# Altium project try 2.PrjPcb
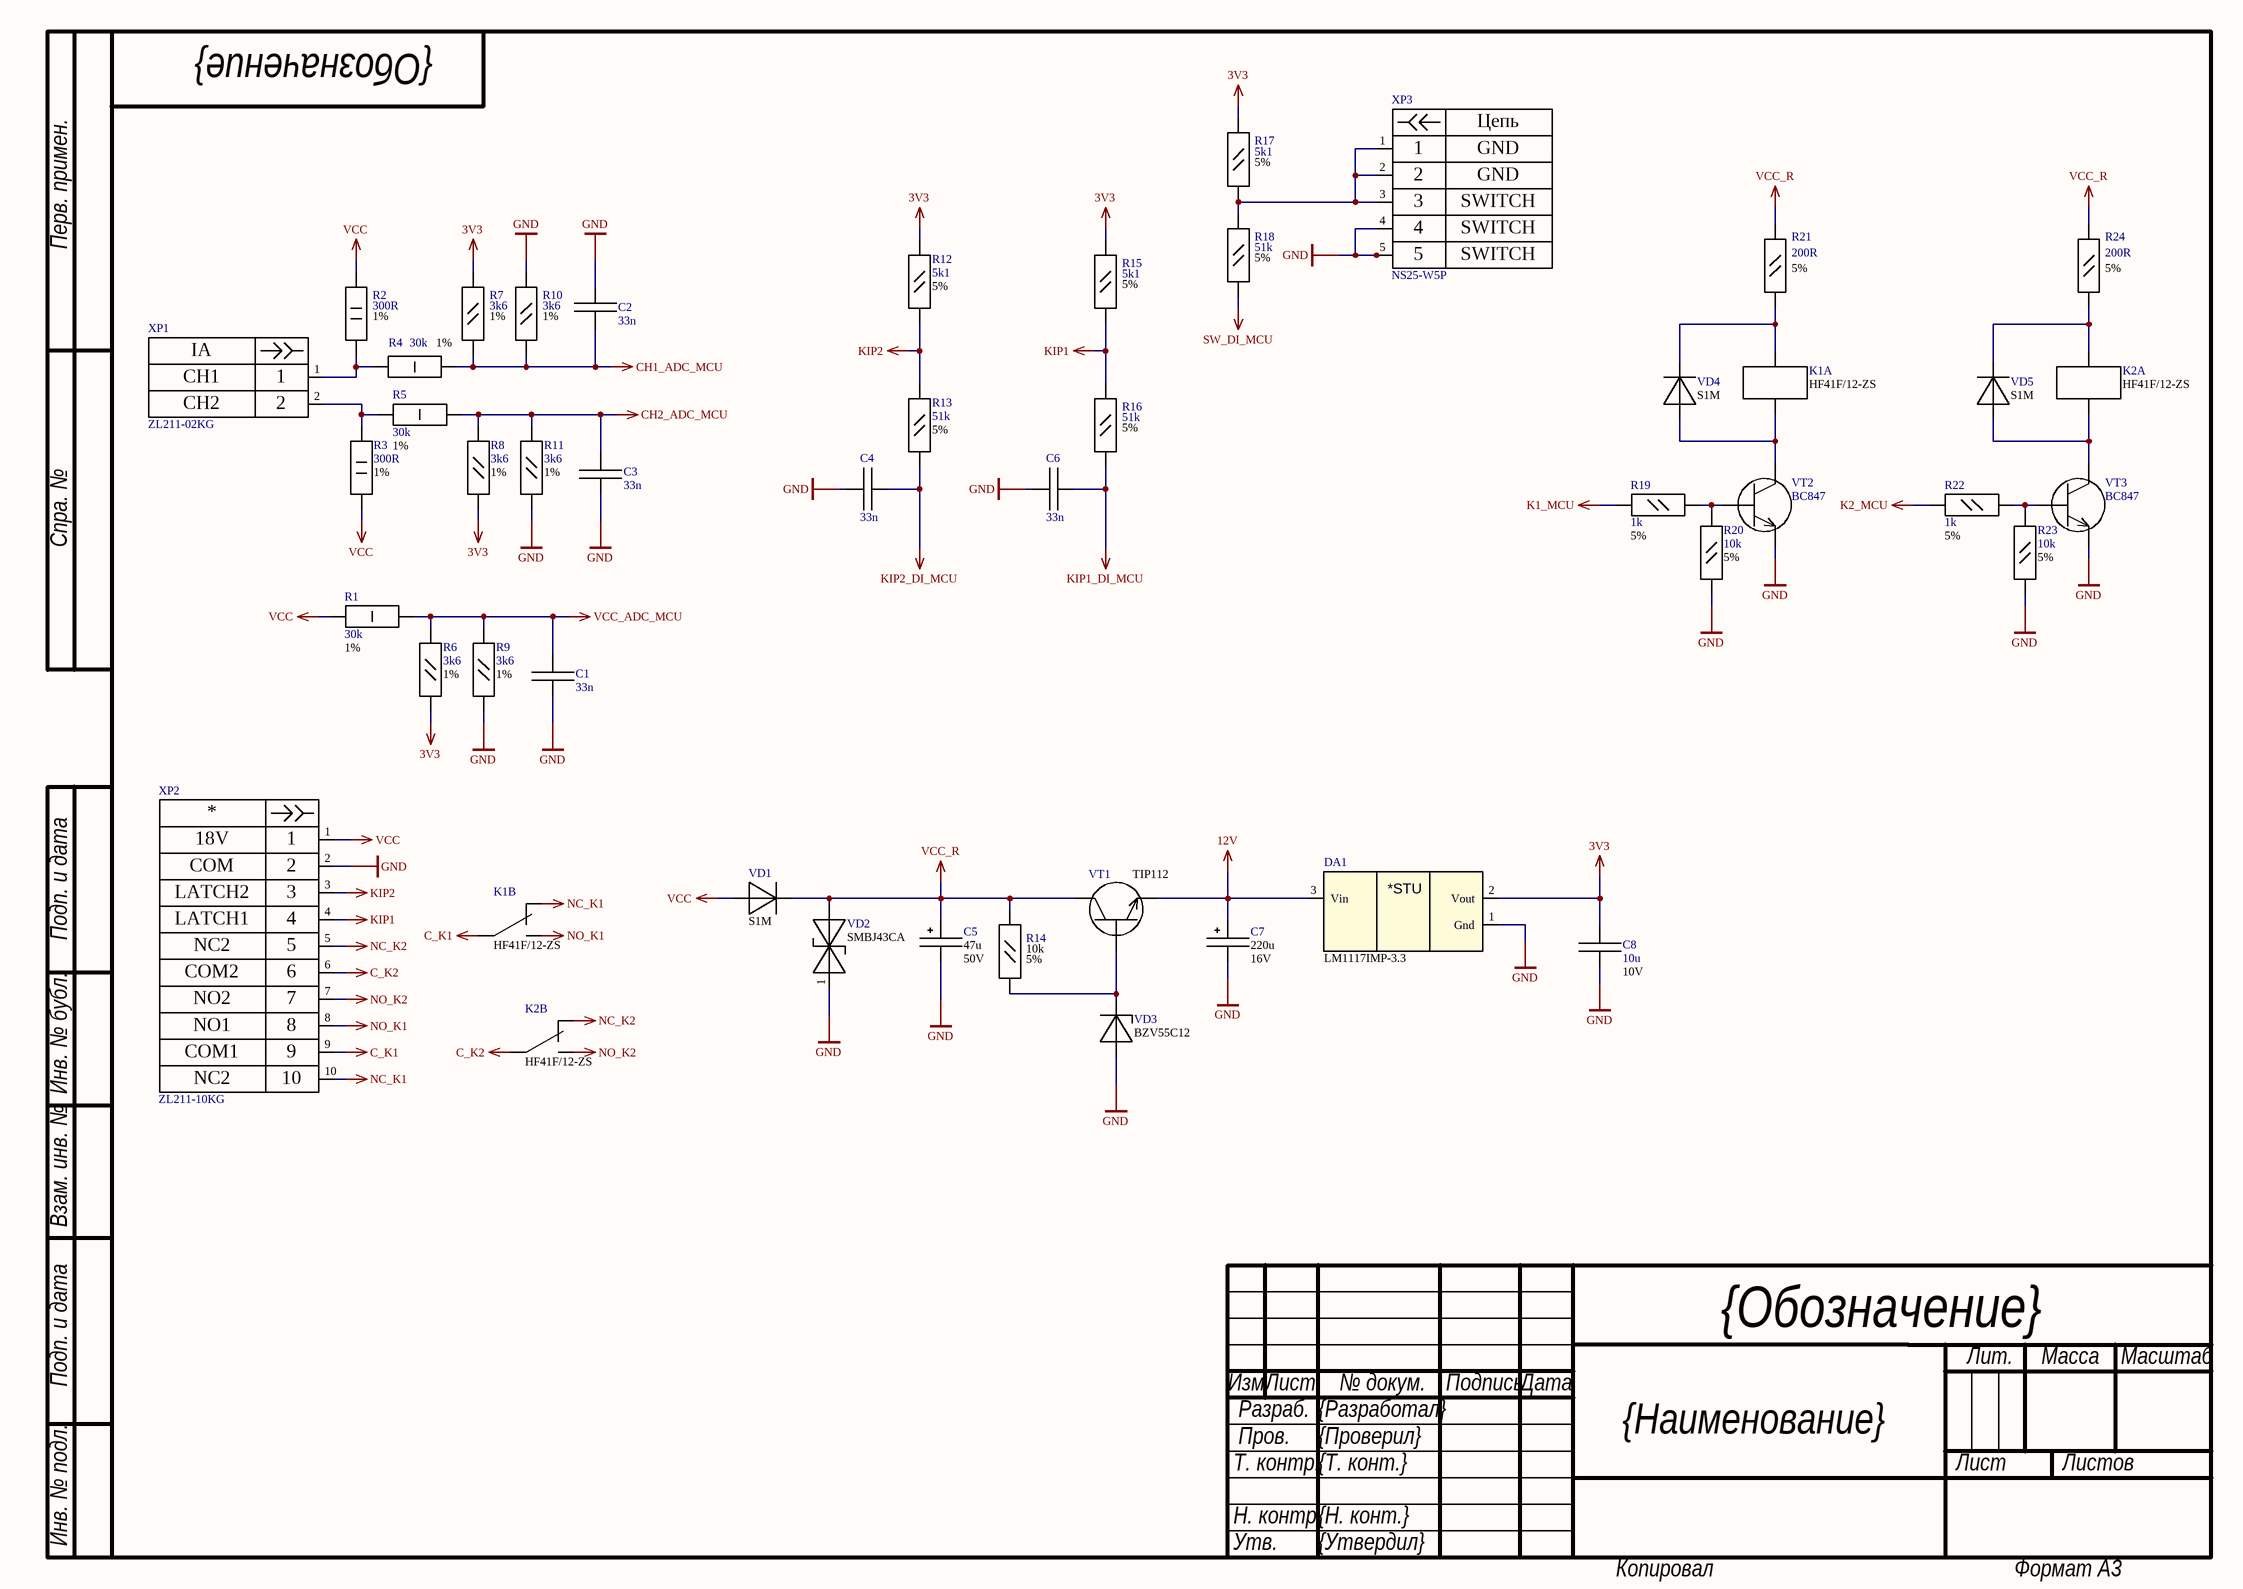
[diagram p0: Sheet2.SchDoc]
2 sheets, 64 parts. Net scope: global (net labels, ports and power ports of the same name join across sheets).
Board file: PCB1.PcbDoc
Sheets:
  Sheet2.SchDoc
  Sheet3.SchDoc

## Sheet Sheet2.SchDoc
size 420 x 297 mm; SheetNumber: 1; SheetTotal: 2; Razrabotal: {Разработал}; Prov: {Проверил}; Tkont: {Т. конт.}; Nkont: {Н. конт.}; Utv: {Утвердил}; Naimenovanie: {Наименование}; Oboznachenie: {Обозначение}; Shifr: {Шифр}

### Parts
C1  33n  [Cap Ceramic 0805]
C2  33n  [Cap Ceramic 0805]
C3  33n  [Cap Ceramic 0805]
C4  33n  [Cap Ceramic 0805]
C5  47u  Comments: 50V  [Cap electro d6.3x2.54mm]
C6  33n  [Cap Ceramic 0805]
C7  220u  Comments: 16V  [Cap electro d6.3x2.54mm]
C8  10u  Comments: 10V  [Cap Ceramic 1206]
DA1  LM1117IMP-3.3  [SOT-232]
K1  HF41F/12-ZS  [RM699V]  (parts A,B of 2)
K2  HF41F/12-ZS  [RM699V]  (parts A,B of 2)
R1  30k  Comments: 1%  [Resistor 2512]
R2  300R  Comments: 1%  [Resistor 2W d5.08x20.32 axial]
R3  300R  Comments: 1%  [Resistor 2W d5.08x20.32 axial]
R4  30k  Comments: 1%  [Resistor 2512]
R5  30k  Comments: 1%  [Resistor 2512]
R6  3k6  Comments: 1%  [Resistor 0805]
R7  3k6  Comments: 1%  [Resistor 0805]
R8  3k6  Comments: 1%  [Resistor 0805]
R9  3k6  Comments: 1%  [Resistor 0805]
R10  3k6  Comments: 1%  [Resistor 0805]
R11  3k6  Comments: 1%  [Resistor 0805]
R12  5k1  Comments: 5%  [Resistor 0805]
R13  51k  Comments: 5%  [Resistor 0805]
R14  10k  Comments: 5%  [Resistor 0805]
R15  5k1  Comments: 5%  [Resistor 0805]
R16  51k  Comments: 5%  [Resistor 0805]
R17  5k1  Comments: 5%  [Resistor 0805]
R18  51k  Comments: 5%  [Resistor 0805]
R19  1k  Comments: 5%  [Resistor 0805]
R20  10k  Comments: 5%  [Resistor 0805]
R21  200R  Comments: 5%  [Resistor 0805]
R22  1k  Comments: 5%  [Resistor 0805]
R23  10k  Comments: 5%  [Resistor 0805]
R24  200R  Comments: 5%  [Resistor 0805]
VD1  S1M  [DO-214AC SMA]
VD2  SMBJ43CA  [DO-214AA SMB]
VD3  BZV55C12  [SOD80C]
VD4  S1M  [DO-214AC SMA]
VD5  S1M  [DO-214AC SMA]
VT1  TIP112  [TO-220]
VT2  BC847  [SOT-23-3]
VT3  BC847  [SOT-23-3]
XP1  ZL211-02KG  Name1: CH1  Name: IA  Name2: CH2  [Pins 1x2]
XP2  ZL211-10KG  Name1: 18V  Name2: COM  Name3: LATCH2  Name4: LATCH1  Name5: NC2  Name6: COM2  Name7: NO2  Name8: NO1  Name9: COM1  [Pins 1x10]
XP3  NS25-W5P  Name1: GND  Name: Цепь  Name3: SWITCH  [WF-05]

### Nets
3V3: C8.2 DA1.2(Vout) R6.1 R7.1 R8.1 R12.1 R15.1 R17.1
12V: C7.2 DA1.3(Vin) VT1.3(E)
C_K1: K1.11 XP2.9
C_K2: K2.11 XP2.6
CH1_ADC_MCU: C2.2 R4.2 R7.2 R10.2
CH2_ADC_MCU: C3.2 R5.2 R8.2 R11.2
GND: C1.1 C2.1 C3.1 C4.2 C5.1 C6.2 C7.1 C8.1 DA1.1(Gnd) R9.1 R10.1 R11.1 R20.2 R23.2 VD2.1 VD3.1(A) VT2.2(E) VT3.2(E) XP2.2 XP3.4 XP3.5
K1_MCU: R19.2
K2_MCU: R22.2
KIP1: R15.2 R16.1 XP2.4
KIP1_DI_MCU: C6.1 R16.2
KIP2: R12.2 R13.1 XP2.3
KIP2_DI_MCU: C4.1 R13.2
NC_K1: K1.12 XP2.10
NC_K2: K2.12 XP2.5
NO_K1: K1.14 XP2.8
NO_K2: K2.14 XP2.7
SW_DI_MCU: R18.2
VCC: R1.1 R2.2 R3.2 VD1.1(A) XP2.1
VCC_ADC_MCU: C1.2 R1.2 R6.2 R9.2
VCC_R: C5.2 R14.1 R21.2 R24.2 VD1.2(K) VD2.2 VT1.2(K)
NetK1_1: K1.1 R21.1 VD4.2(K)
NetK1_2: K1.2 VD4.1(A) VT2.3(K)
NetK2_1: K2.1 R24.1 VD5.2(K)
NetK2_2: K2.2 VD5.1(A) VT3.3(K)
NetR2_1: R2.1 R4.1 XP1.1
NetR3_1: R3.1 R5.1 XP1.2
NetR14_2: R14.2 VD3.2(K) VT1.1(B)
NetR17_2: R17.2 R18.1 XP3.1 XP3.2 XP3.3
NetR19_1: R19.1 R20.1 VT2.1(B)
NetR22_1: R22.1 R23.1 VT3.1(B)

### Notes on the sheet
- Перв. примен.
- Спра. №
- Подп. и дата
- Инв. № бубл.
- Взам. инв. №
- Изм
- Лист
- № докум.
- Подпись
- Дата
- Лит.
- Масса
- Масштаб
- Т. контр.
- Разраб.
- Пров.
- Листов
- Инв. № подл.
- Н. контр.
- Утв.
- Копировал
- Формат А3
- (in symbol LM1117IMP-x.x) *STU

### Library data of the parts
C1-C4 C6 C8 = CerCap
  C1-C4 C6: Comments: *
C5 C7 = ECap
DA1 = LM1117IMP-x.x: Comments: *
K1 K2 = RM699V-xx11-85-xxxx: Comments: *
R1 R4 R5 = Resistor 1W
R2 R3 = Resistor 2W
R6-R24 = Resistor 0,125W
VD2 = SMBJxxCA: Comments: *
VD3 = BZV55Cxx: Comments: *
VT1 = BDW93C
XP1 = Pins 1x2: Comments: *
XP2 = Pins 1x10: Comments: *; Name: *; Name10: NC2
XP3 = Pins 1x5: Comments: *; Name2: GND; Name4: SWITCH; Name5: SWITCH
VD1 VD4 VD5 = S1M: Comments: *
VT2 VT3 = BC847: Comments: *

## Sheet Sheet3.SchDoc
size 420 x 297 mm; SheetNumber: 2; SheetTotal: 2; Razrabotal: {Разработал}; Prov: {Проверил}; Tkont: {Т. конт.}; Nkont: {Н. конт.}; Utv: {Утвердил}; Naimenovanie: {Наименование}; Oboznachenie: {Обозначение}; Shifr: {Шифр}
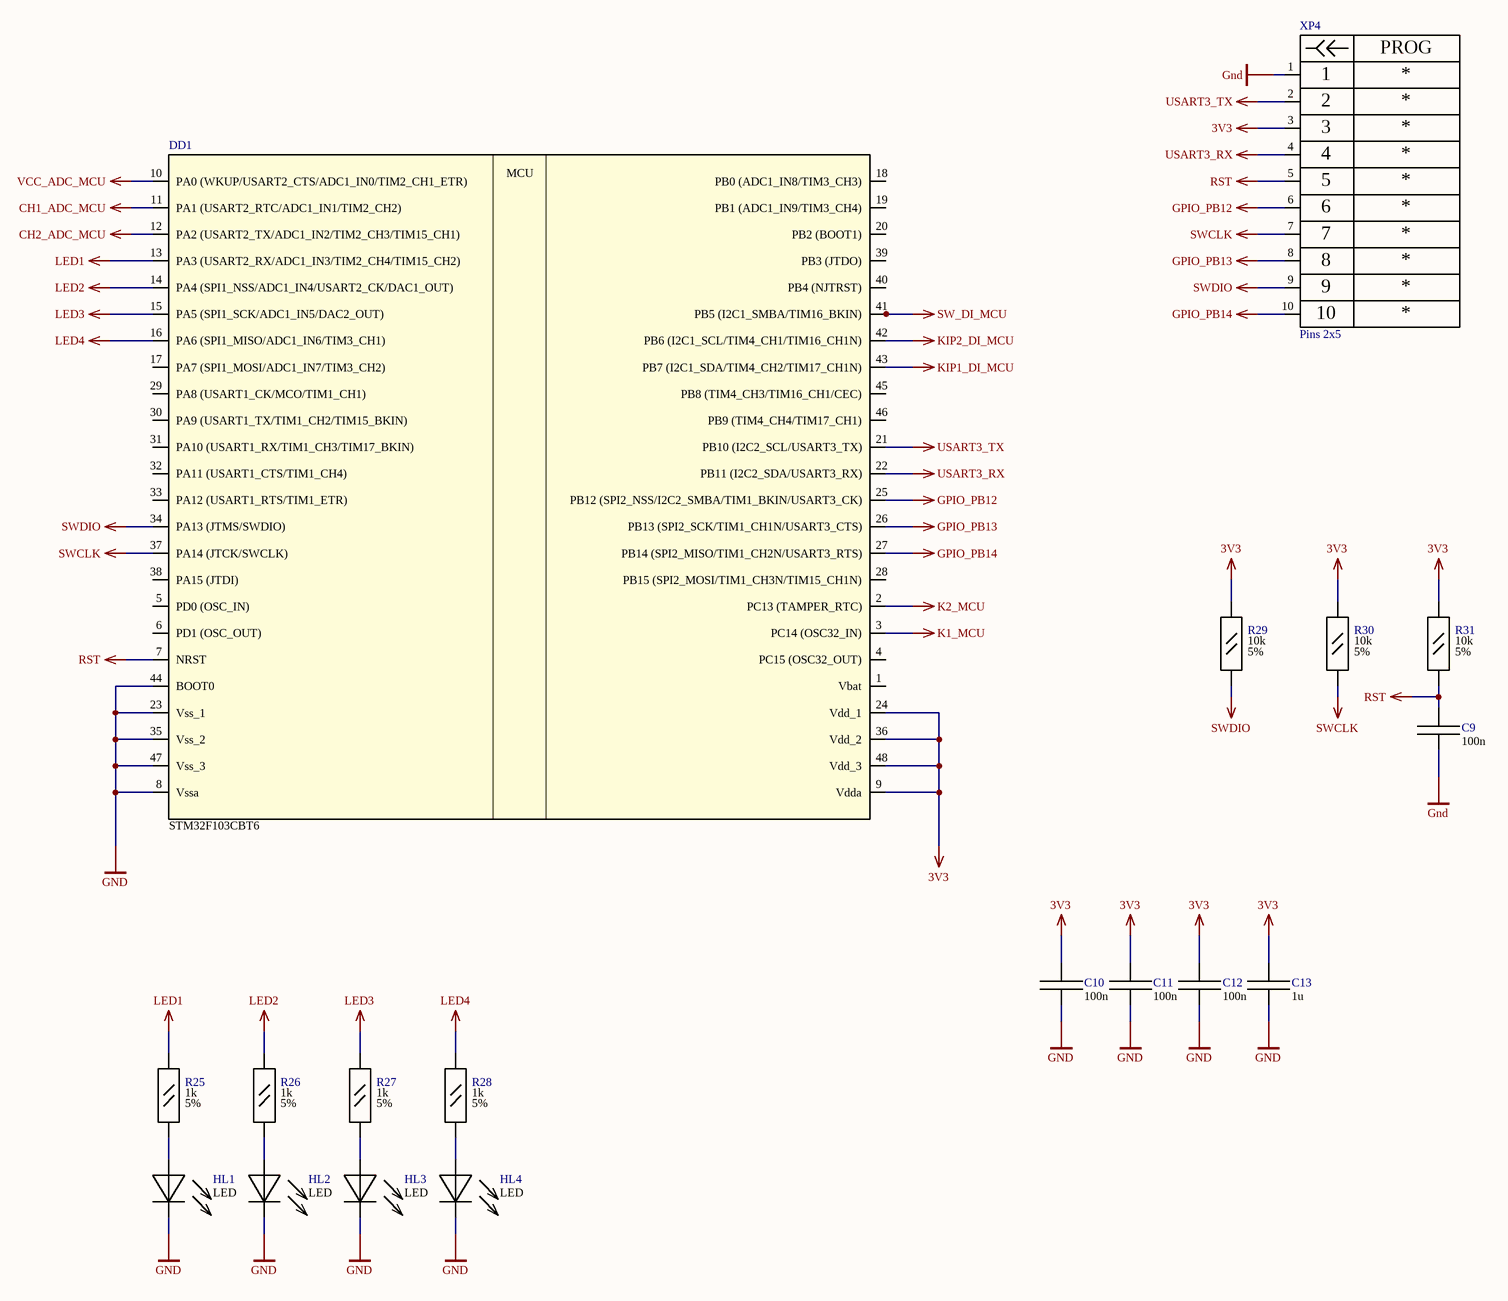
[diagram p1: Sheet3.SchDoc]

### Parts
C9  100n  [Cap Ceramic 0805]
C10  100n  [Cap Ceramic 0805]
C11  100n  [Cap Ceramic 0805]
C12  100n  [Cap Ceramic 0805]
C13  1u  [Cap Ceramic 0805]
DD1  STM32F103CBT6  [TQFP48/QFN48 S0.5]
HL1  LED  [LED S2.54d3.0]
HL2  LED  [LED S2.54d3.0]
HL3  LED  [LED S2.54d3.0]
HL4  LED  [LED S2.54d3.0]
R25  1k  Comments: 5%  [Resistor 0805]
R26  1k  Comments: 5%  [Resistor 0805]
R27  1k  Comments: 5%  [Resistor 0805]
R28  1k  Comments: 5%  [Resistor 0805]
R29  10k  Comments: 5%  [Resistor 0805]
R30  10k  Comments: 5%  [Resistor 0805]
R31  10k  Comments: 5%  [Resistor 0805]
XP4  Pins 2x5  Name: PROG  [Pins 2x5 - 1.27]

### Nets
3V3: C10.2 C11.2 C12.2 C13.2 DD1.9(Vdda) DD1.24(Vdd_1) DD1.36(Vdd_2) DD1.48(Vdd_3) R29.1 R30.1 R31.1 XP4.3
CH1_ADC_MCU: DD1.11(PA1_(USART2_RTC/ADC1_IN1/TIM2_CH2))
CH2_ADC_MCU: DD1.12(PA2_(USART2_TX/ADC1_IN2/TIM2_CH3/TIM15_CH1))
GND: C9.1 C10.1 C11.1 C12.1 C13.1 DD1.8(Vssa) DD1.23(Vss_1) DD1.35(Vss_2) DD1.44(BOOT0) DD1.47(Vss_3) HL1.2(K) HL2.2(K) HL3.2(K) HL4.2(K) XP4.1
GPIO_PB12: DD1.25(PB12_(SPI2_NSS/I2C2_SMBA/TIM1_BKIN/USART3_CK)) XP4.6
GPIO_PB13: DD1.26(PB13_(SPI2_SCK/TIM1_CH1N/USART3_CTS)) XP4.8
GPIO_PB14: DD1.27(PB14_(SPI2_MISO/TIM1_CH2N/USART3_RTS)) XP4.10
K1_MCU: DD1.3(PC14_(OSC32_IN))
K2_MCU: DD1.2(PC13_(TAMPER_RTC))
KIP1_DI_MCU: DD1.43(PB7_(I2C1_SDA/TIM4_CH2/TIM17_CH1N))
KIP2_DI_MCU: DD1.42(PB6_(I2C1_SCL/TIM4_CH1/TIM16_CH1N))
LED1: DD1.13(PA3_(USART2_RX/ADC1_IN3/TIM2_CH4/TIM15_CH2)) R25.1
LED2: DD1.14(PA4_(SPI1_NSS/ADC1_IN4/USART2_CK/DAC1_OUT)) R26.1
LED3: DD1.15(PA5_(SPI1_SCK/ADC1_IN5/DAC2_OUT)) R27.1
LED4: DD1.16(PA6_(SPI1_MISO/ADC1_IN6/TIM3_CH1)) R28.1
RST: C9.2 DD1.7(NRST) R31.2 XP4.5
SW_DI_MCU: DD1.41(PB5_(I2C1_SMBA/TIM16_BKIN))
SWCLK: DD1.37(PA14_(JTCK/SWCLK)) R30.2 XP4.7
SWDIO: DD1.34(PA13_(JTMS/SWDIO)) R29.2 XP4.9
USART3_RX: DD1.22(PB11_(I2C2_SDA/USART3_RX)) XP4.4
USART3_TX: DD1.21(PB10_(I2C2_SCL/USART3_TX)) XP4.2
VCC_ADC_MCU: DD1.10(PA0_(WKUP/USART2_CTS/ADC1_IN0/TIM2_CH1_ETR))
NetHL1_1: HL1.1(A) R25.2
NetHL2_1: HL2.1(A) R26.2
NetHL3_1: HL3.1(A) R27.2
NetHL4_1: HL4.1(A) R28.2

Not connected (* = marked no-connect by the designer): DD1 1(Vbat) 4(PC15_(OSC32_OUT)) 5(PD0_(OSC_IN)) 6(PD1_(OSC_OUT)) 17(PA7_(SPI1_MOSI/ADC1_IN7/TIM3_CH2)) 18(PB0_(ADC1_IN8/TIM3_CH3)) 19(PB1_(ADC1_IN9/TIM3_CH4)) 20(PB2_(BOOT1)) 28(PB15_(SPI2_MOSI/TIM1_CH3N/TIM15_CH1N)) 29(PA8_(USART1_CK/MCO/TIM1_CH1)) 30(PA9_(USART1_TX/TIM1_CH2/TIM15_BKIN)) 31(PA10_(USART1_RX/TIM1_CH3/TIM17_BKIN)) 32(PA11_(USART1_CTS/TIM1_CH4)) 33(PA12_(USART1_RTS/TIM1_ETR)) 38(PA15_(JTDI)) 39(PB3_(JTDO)) 40(PB4_(NJTRST)) 45(PB8_(TIM4_CH3/TIM16_CH1/CEC)) 46(PB9_(TIM4_CH4/TIM17_CH1))

### Notes on the sheet
- Перв. примен.
- Спра. №
- Подп. и дата
- Инв. № бубл.
- Взам. инв. №
- Инв. № подл.
- Лист
- Изм
- № докум.
- Подпись
- Дата
- Копировал
- Формат А3
- (in symbol STM32F100C4T6) MCU

### Library data of the parts
C9-C13 = CerCap: Comments: *
DD1 = STM32F100C4T6
R25-R31 = Resistor 0,125W
HL1-HL4 = LED: Comments: *
XP4 = Pins 2x5: Comments: *; Name1: *; Name2: *; Name3: *; Name4: *; Name5: *; Name6: *; Name7: *; Name8: *; Name9: *; Name10: *

## Nets that join several sheets
3V3: Sheet2 (8 pins), Sheet3 (12 pins)
CH1_ADC_MCU: Sheet2 (C2.2 R4.2 R7.2 R10.2), Sheet3 (DD1.11)
CH2_ADC_MCU: Sheet2 (C3.2 R5.2 R8.2 R11.2), Sheet3 (DD1.12)
GND: Sheet2 (21 pins), Sheet3 (15 pins)
K1_MCU: Sheet2 (R19.2), Sheet3 (DD1.3)
K2_MCU: Sheet2 (R22.2), Sheet3 (DD1.2)
KIP1_DI_MCU: Sheet2 (C6.1 R16.2), Sheet3 (DD1.43)
KIP2_DI_MCU: Sheet2 (C4.1 R13.2), Sheet3 (DD1.42)
SW_DI_MCU: Sheet2 (R18.2), Sheet3 (DD1.41)
VCC_ADC_MCU: Sheet2 (C1.2 R1.2 R6.2 R9.2), Sheet3 (DD1.10)